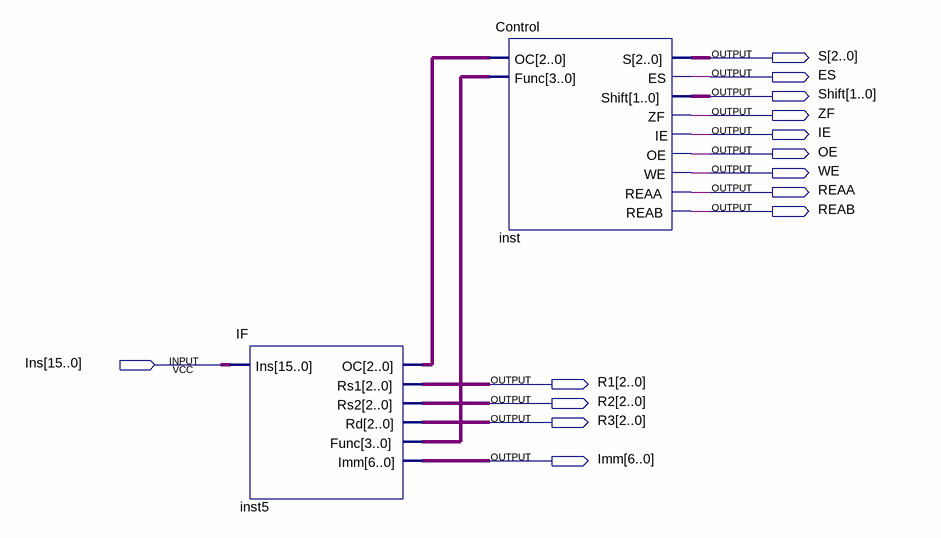
[diagram p0: schematic sheet]
// Quartus schematic Controller_Design.bdf as structural Verilog: 2 symbols, 14 pins
module Controller_Design (
  input  [15:0] Ins,
  output [2:0] S,
  output ES,
  output [1:0] Shift,
  output ZF,
  output IE,
  output OE,
  output WE,
  output REAA,
  output REAB,
  output [2:0] R1,
  output [2:0] R2,
  output [2:0] R3,
  output [6:0] Imm
);

  wire [2:0] inst5_oc;
  wire [3:0] inst5_func;

  IF inst5 (.Ins(Ins), .OC(inst5_oc), .Rs1(R1), .Rs2(R2), .Rd(R3), .Func(inst5_func), .Imm(Imm));
  Control inst (
    .OC(inst5_oc), .Func(inst5_func), .S(S), .ES(ES), .Shift(Shift), .ZF(ZF), .IE(IE), .OE(OE), .WE(WE),
    .REAA(REAA), .REAB(REAB));
endmodule
